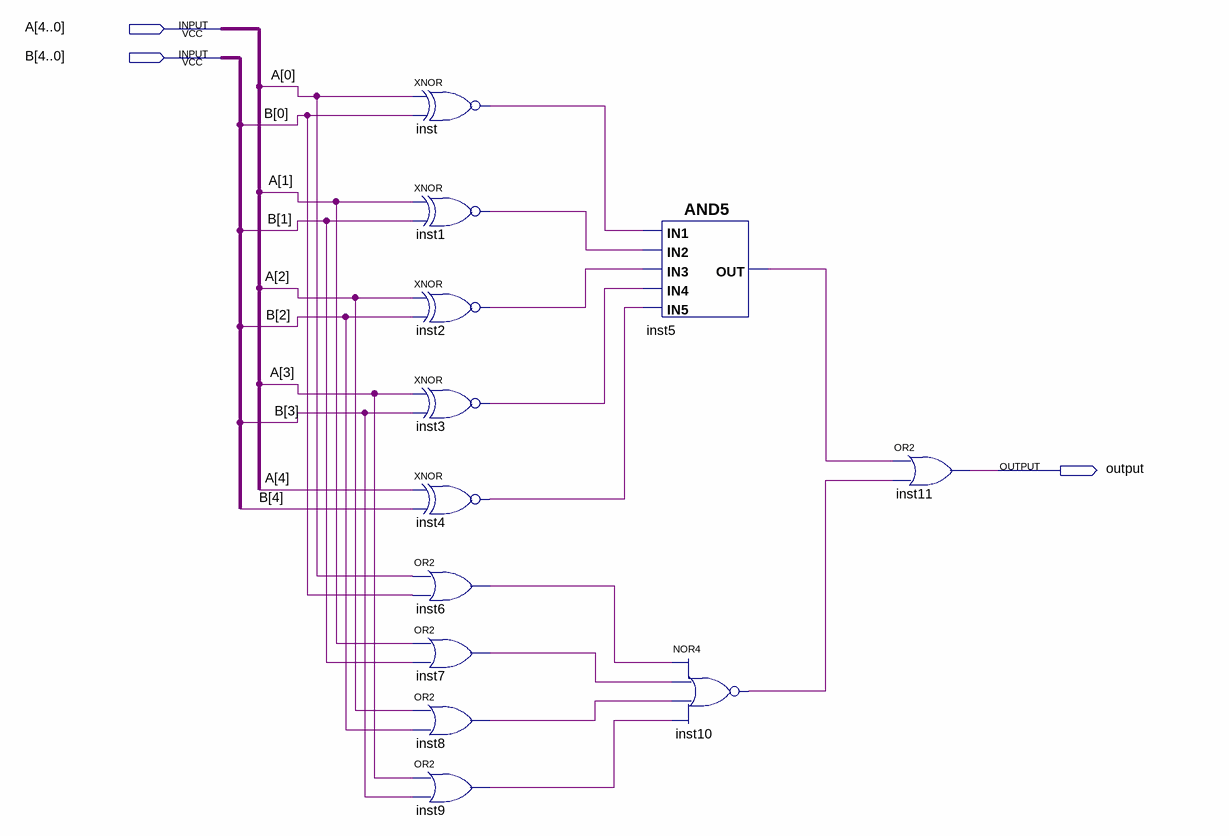
[diagram p0: schematic sheet]
// Quartus schematic IgualCompleto.bdf as structural Verilog: 12 symbols, 3 pins
module IgualCompleto (
  input  [4:0] A,
  input  [4:0] B,
  output \output 
);

  wire inst1_out, inst2_out, inst3_out, inst4_out, inst5_out, inst6_out, inst7_out, inst8_out, inst9_out,
       inst10_out, inst_out;

  xnor inst (inst_out, A[0], B[0]);
  xnor inst1 (inst1_out, A[1], B[1]);
  xnor inst2 (inst2_out, A[2], B[2]);
  xnor inst3 (inst3_out, A[3], B[3]);
  xnor inst4 (inst4_out, A[4], B[4]);
  or inst6 (inst6_out, A[0], B[0]);
  or inst7 (inst7_out, A[1], B[1]);
  or inst8 (inst8_out, A[2], B[2]);
  or inst9 (inst9_out, A[3], B[3]);
  and inst5 (inst5_out, inst_out, inst1_out, inst2_out, inst3_out, inst4_out);
  nor inst10 (inst10_out, inst6_out, inst7_out, inst8_out, inst9_out);
  or inst11 (\output , inst5_out, inst10_out);
endmodule
